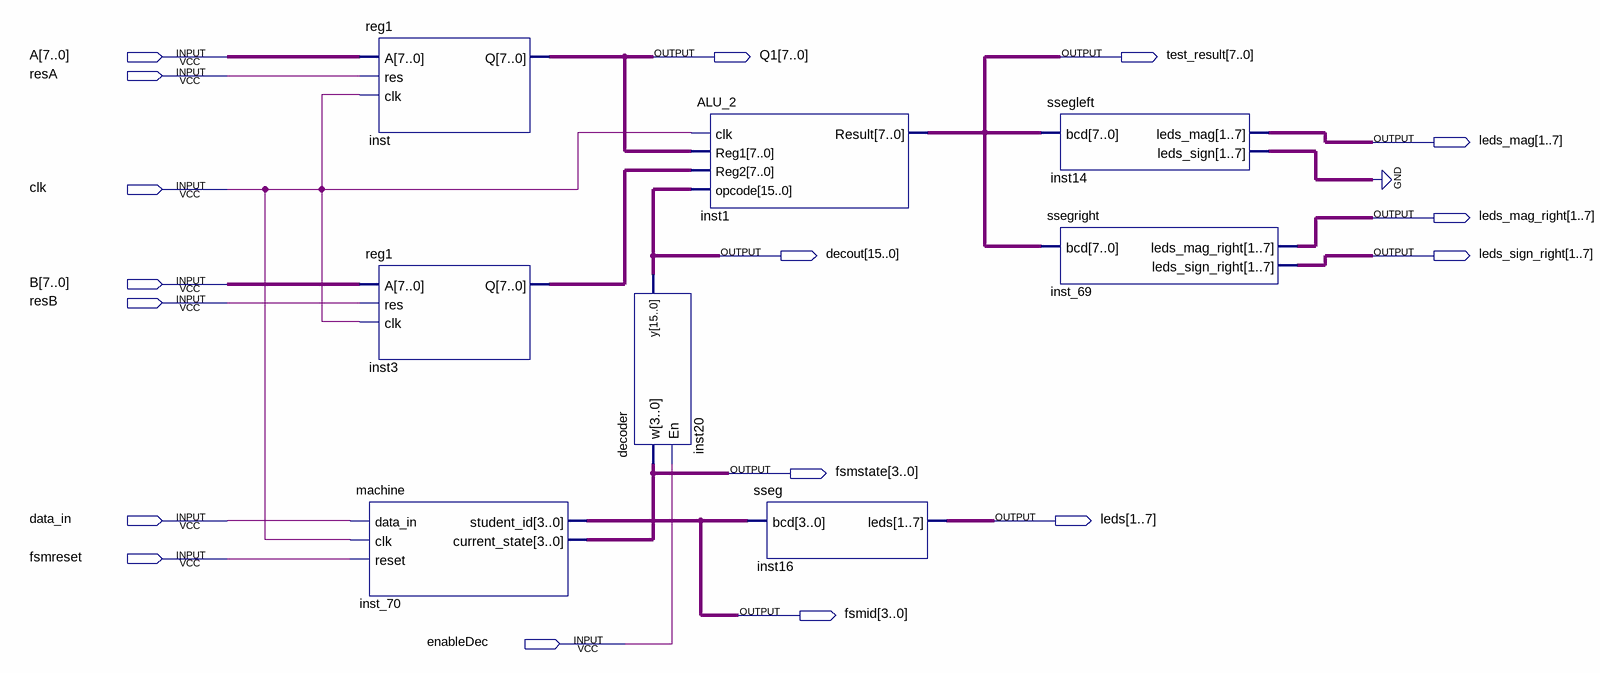
[diagram p0: schematic sheet]
// Quartus schematic lab6.bdf as structural Verilog: 8 symbols, 17 pins
module lab6 (
  input  [7:0] A,
  input  resA,
  input  clk,
  input  [7:0] B,
  input  resB,
  input  data_in,
  input  fsmreset,
  input  enableDec,
  output [7:0] Q1,
  output [7:0] test_result,
  output [1:7] leds_mag,
  output [1:7] leds_mag_right,
  output [15:0] decout,
  output [1:7] leds_sign_right,
  output [3:0] fsmstate,
  output [1:7] leds,
  output [3:0] fsmid
);

  wire [6:0] inst14_leds_sign;
  wire [7:0] inst3_q;

  reg1 inst (.A(A), .res(resA), .clk(clk), .Q(Q1));
  reg1 inst3 (.A(B), .res(resB), .clk(clk), .Q(inst3_q));
  machine inst_70 (.data_in(data_in), .clk(clk), .reset(fsmreset), .student_id(fsmid), .current_state(fsmstate));
  decoder inst20 (.w(fsmstate), .En(enableDec), .y(decout));
  ALU_2 inst1 (.clk(clk), .Reg1(Q1), .Reg2(inst3_q), .opcode(decout), .Result(test_result));
  sseg inst16 (.bcd(fsmid), .leds(leds));
  ssegleft inst14 (.bcd(test_result), .leds_mag(leds_mag), .leds_sign(inst14_leds_sign));
  ssegright inst_69 (.bcd(test_result), .leds_mag_right(leds_mag_right), .leds_sign_right(leds_sign_right));
  // also tied to GND on the sheet: {inst14_leds_sign[0], inst14_leds_sign[1], inst14_leds_sign[2], inst14_leds_sign[3], inst14_leds_sign[4], inst14_leds_sign[5], inst14_leds_sign[6]}
endmodule
